# Altium schematic sheet smart_lock.SchDoc
size A4
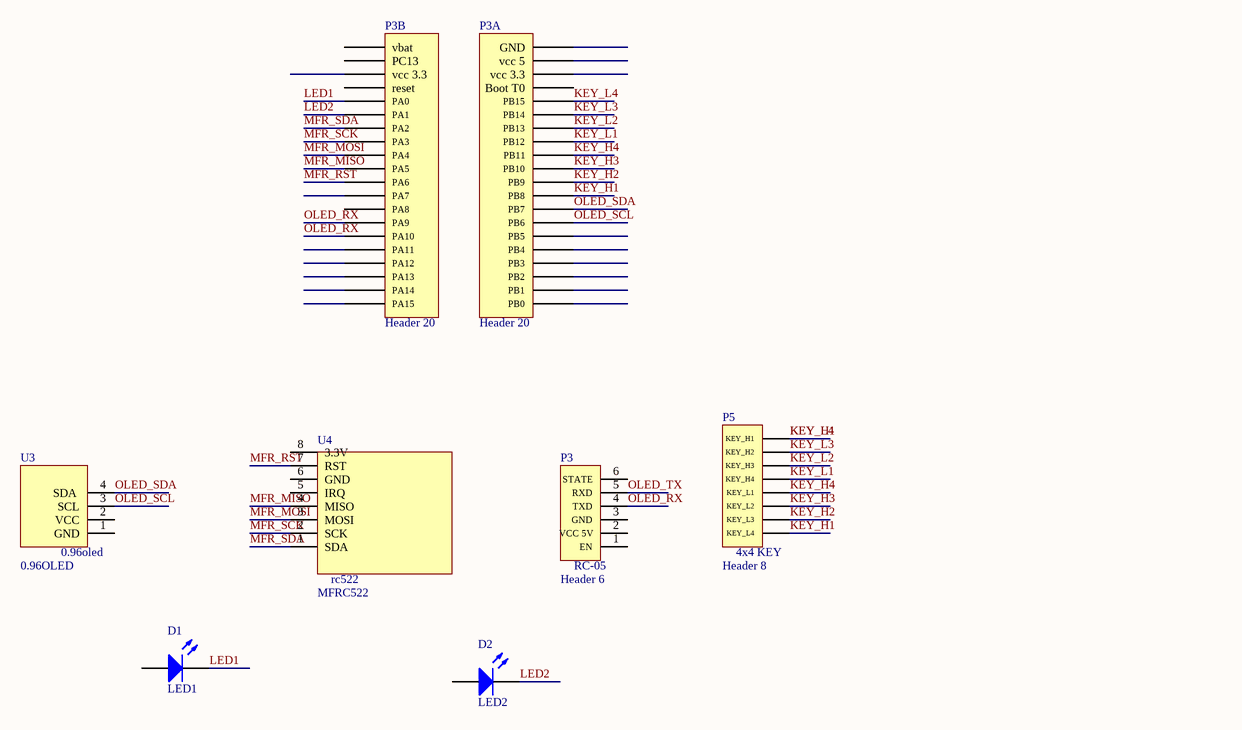
[diagram p0: smart_lock.SchDoc]

## Parts
(Parts that share a designator on the sheet are numbered #1, #2 ... from top to bottom, then left to right.)
D1  LED1  [LED-0]
D2  LED2  [LED-1]
P3#1  Header 20  [HDR1X20]  (parts A,B of 2)
P3#2  Header 6  [HDR1X6]
P5  Header 8  [HDR1X8]
U3  0.96OLED  [0.96OLED_7P]
U4  MFRC522  [PCBComponent_1 - duplicate]

## Nets
KEY_H1: P3#1.11(PB8) P3#1.18(PB15) P5.3(KEY_H1) P5.10(KEY_L4)  [also labelled KEY_L4]
KEY_H2: P3#1.12(PB9) P5.9(KEY_L3)
KEY_H3: P3#1.13(PB10) P5.8(KEY_L2)
KEY_H4: P3#1.14(PB11) P5.7(KEY_L1)
KEY_L1: P3#1.15(PB12) P5.6(KEY_H4)
KEY_L2: P3#1.16(PB13) P5.5(KEY_H3)
KEY_L3: P3#1.17(PB14) P5.4(KEY_H2)
LED1: D1.2(K) P3#1.28(PA0)
LED2: D2.2(K) P3#1.29(PA1)
MFR_MISO: P3#1.33(PA5) U4.4(MISO)
MFR_MOSI: P3#1.32(PA4) U4.3(MOSI)
MFR_RST: P3#1.34(PA6) U4.7(RST)
MFR_SCK: P3#1.31(PA3) U4.2(SCK)
MFR_SDA: P3#1.30(PA2) U4.1(SDA)
OLED_RX: P3#1.37(PA9) P3#1.38(PA10) P3#2.4(TXD)
OLED_SCL: P3#1.9(PB6) U3.3(SCL)
OLED_SDA: P3#1.10(PB7) U3.4(SDA)
OLED_TX: P3#2.5(RXD)

Not connected (* = marked no-connect by the designer): D1 1(A); D2 1(A); P3#1 3(PB0) 4(PB1) 5(PB2) 6(PB3) 7(PB4) 8(PB5) 35(PA7) 36(PA8) 39(PA11) 40(PA12) 41(PA13) 42(PA14) 43(PA15) ?1(GND) ?2(vcc_5) ?3(vcc_3.3) ?4(Boot_T0) vcc 3.3; P3#2 1(EN) 2(VCC_5V) 3(GND) 6(STATE); U3 1(GND) 2(VCC); U4 5(IRQ) 6(GND) 8(3.3V)

## Notes on the sheet
- (in symbol 0.96OLED) 0.96oled
- (in symbol 4x4 Key) 4x4 KEY
- (in symbol Bluetooth) RC-05
- (in symbol MFRC522) rc522

## Library data of the parts
D1 = LED0: Typical INFRARED GaAs LED; Published: 8-Jun-2000; LatestRevisionDate: 08-Jul-2005; LatestRevisionNote: Mech Layer 1 removed.; PackageReference: LED-0; Publisher: Altium Limited; PackageDescription: LED; 2 Leads
D2 = LED1: Typical RED GaAs LED; Published: 8-Jun-2000; LatestRevisionDate: 08-Jul-2005; LatestRevisionNote: Mech Layer 1 removed.; PackageReference: LED-1; Publisher: Altium Limited; PackageDescription: LED; 2 Leads
P3#1 = F103c8t6/IO: Header, 20-Pin; LatestRevisionDate: 17-Jul-2002; LatestRevisionNote: Re-released for DXP Platform.; Publisher: Altium Limited
P3#2 = Bluetooth: Header, 6-Pin; LatestRevisionDate: 17-Jul-2002; LatestRevisionNote: Re-released for DXP Platform.; Publisher: Altium Limited
P5 = 4x4 Key: Header, 8-Pin; LatestRevisionDate: 17-Jul-2002; LatestRevisionNote: Re-released for DXP Platform.; Publisher: Altium Limited